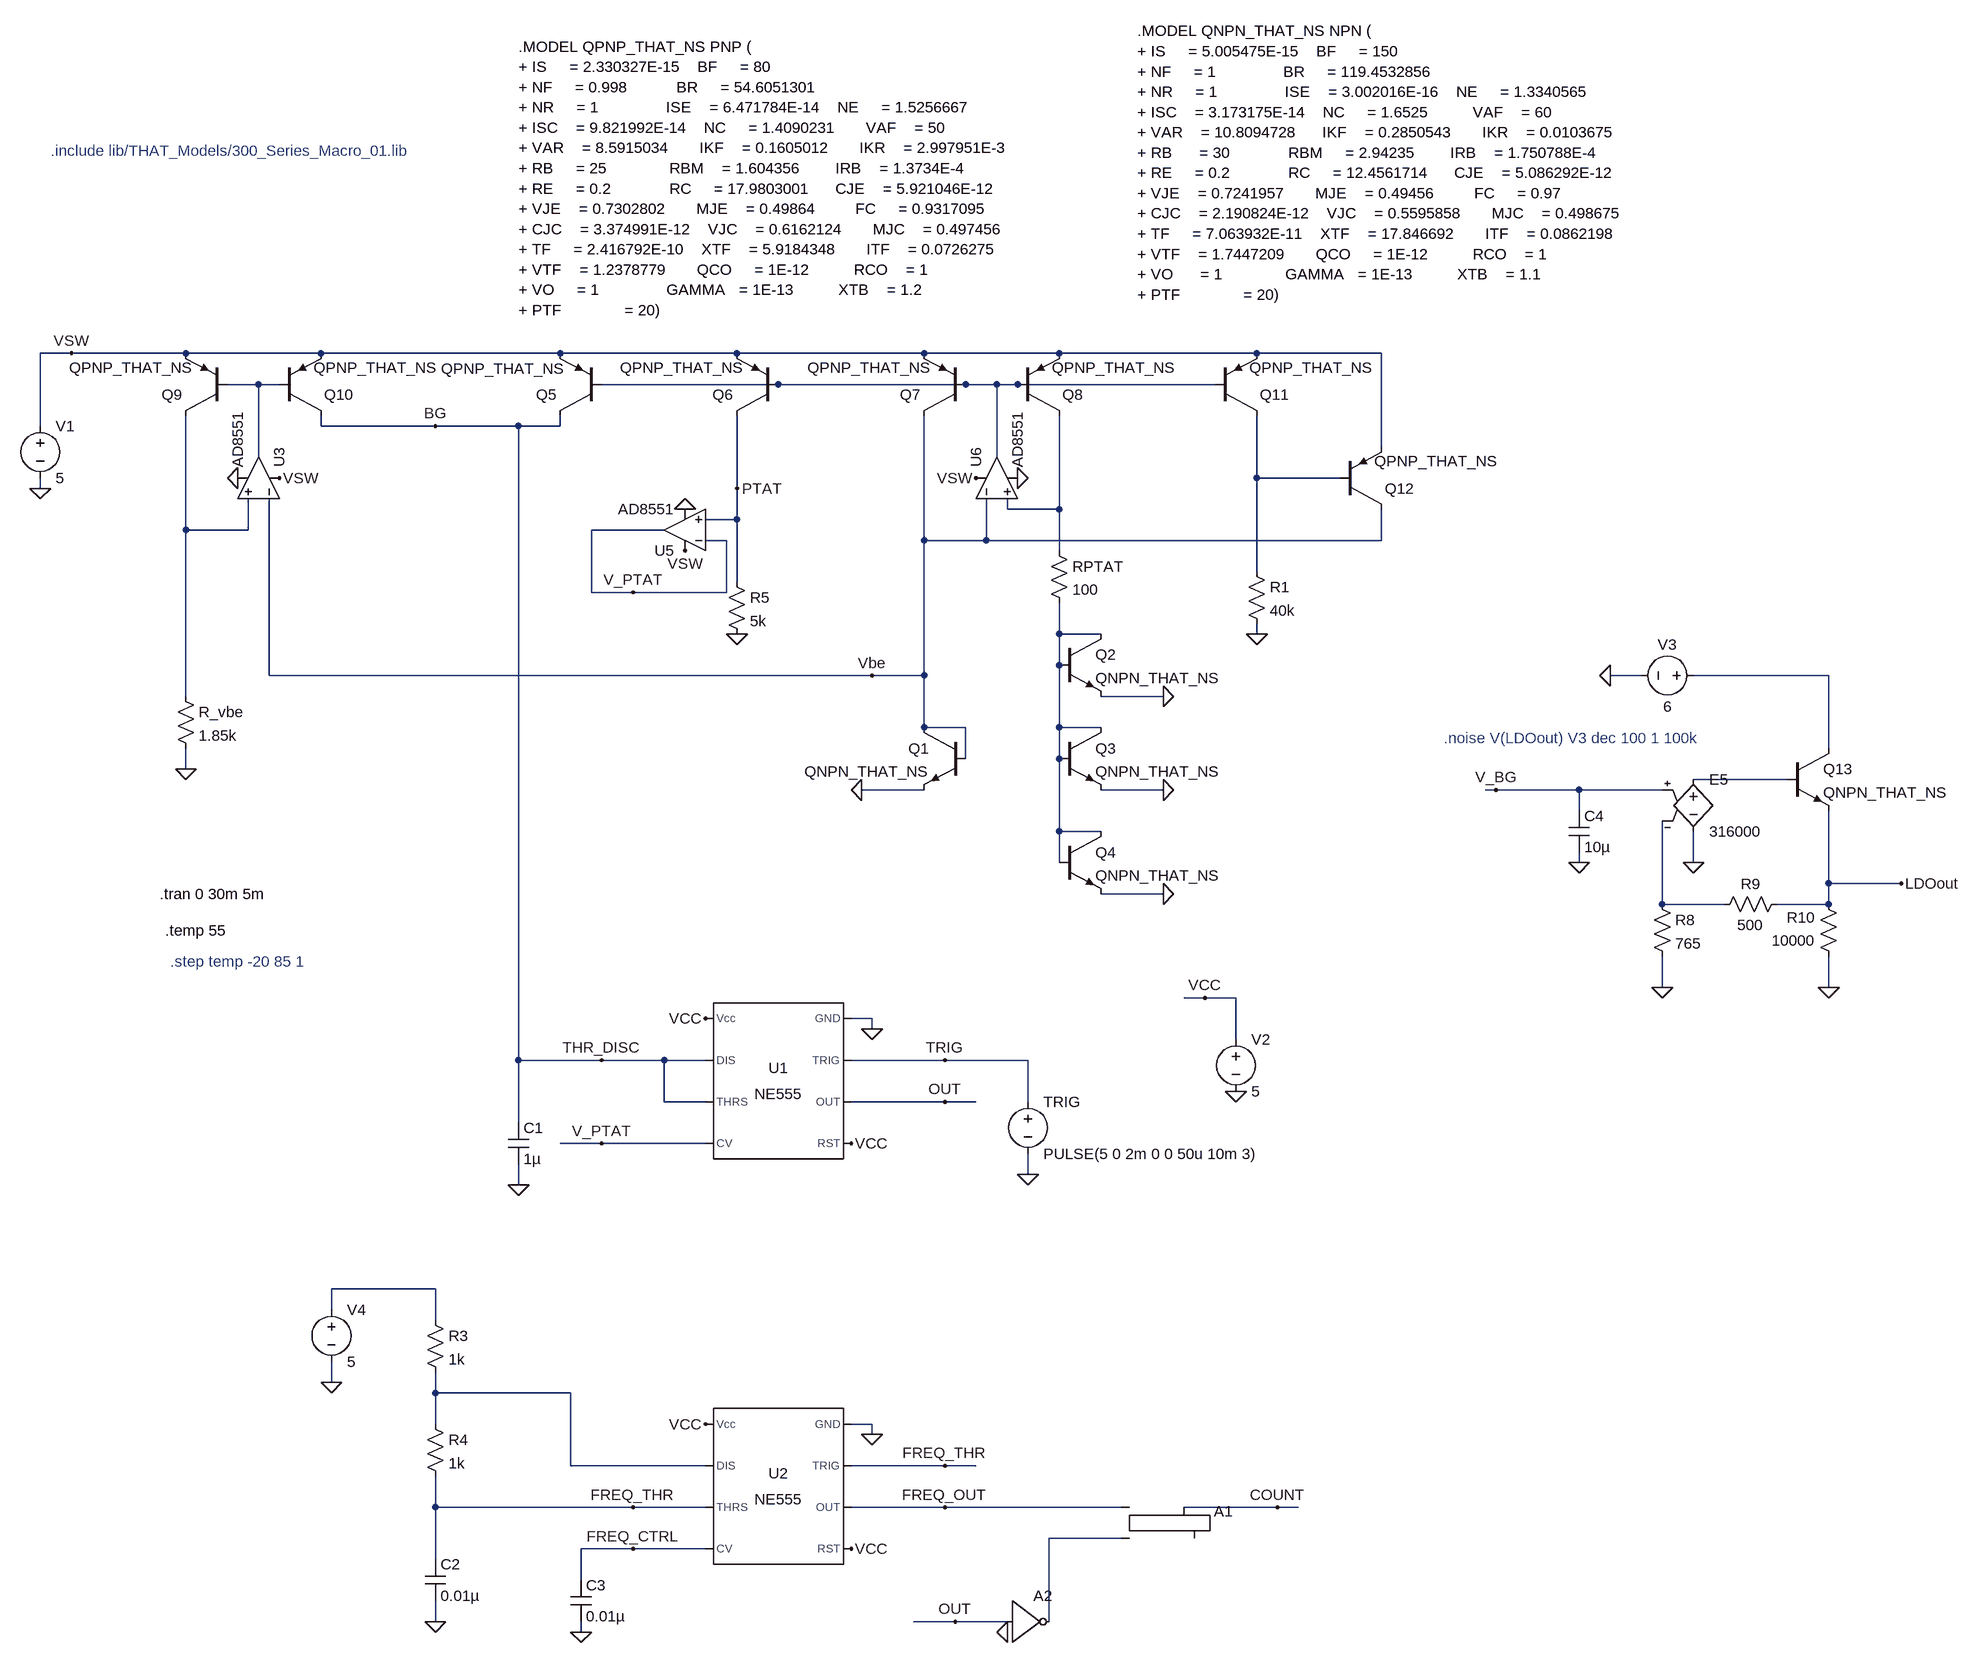
[diagram p0: schematic ECE_115D_555_Timer_IC.asc]
ECE_115D_555_Timer_IC.asc, the LTspice schematic file:
Version 4
SHEET 1 1912 2372
WIRE -1008 112 -1056 112
WIRE -832 112 -1008 112
WIRE -624 112 -832 112
WIRE -256 112 -624 112
WIRE 16 112 -256 112
WIRE 304 112 16 112
WIRE 512 112 304 112
WIRE 816 112 512 112
WIRE 1008 112 816 112
WIRE -720 160 -768 160
WIRE -688 160 -720 160
WIRE 80 160 -192 160
WIRE 368 160 80 160
WIRE 416 160 368 160
WIRE 448 160 416 160
WIRE 752 160 448 160
WIRE -1056 224 -1056 112
WIRE -624 224 -624 208
WIRE -448 224 -624 224
WIRE -320 224 -448 224
WIRE -256 224 -256 208
WIRE -256 224 -320 224
WIRE 1008 256 1008 112
WIRE -720 272 -720 160
WIRE 416 272 416 160
WIRE 816 304 816 208
WIRE 944 304 816 304
WIRE -1056 320 -1056 304
WIRE 16 320 16 208
WIRE 432 352 432 336
WIRE 512 352 512 208
WIRE 512 352 432 352
WIRE 16 368 16 320
WIRE 16 368 -32 368
WIRE -832 384 -832 208
WIRE -736 384 -736 336
WIRE -736 384 -832 384
WIRE -96 384 -208 384
WIRE 0 400 -32 400
WIRE 304 400 304 208
WIRE 400 400 400 336
WIRE 400 400 304 400
WIRE 1008 400 1008 352
WIRE 1008 400 400 400
WIRE 512 416 512 352
WIRE 816 448 816 304
WIRE 16 464 16 368
WIRE -208 480 -208 384
WIRE -144 480 -208 480
WIRE 0 480 0 400
WIRE 0 480 -144 480
WIRE 512 544 512 496
WIRE 576 544 512 544
WIRE 816 544 816 528
WIRE 512 592 512 544
WIRE -704 608 -704 336
WIRE 224 608 -704 608
WIRE 304 608 304 400
WIRE 304 608 224 608
WIRE 1408 608 1360 608
WIRE 1696 608 1488 608
WIRE -832 640 -832 384
WIRE 672 640 576 640
WIRE 304 688 304 608
WIRE 368 688 304 688
WIRE 512 688 512 592
WIRE 576 688 512 688
WIRE 1696 720 1696 608
WIRE 368 736 368 688
WIRE 512 736 512 688
WIRE -832 752 -832 720
WIRE 1632 768 1488 768
WIRE 304 784 208 784
WIRE 672 784 576 784
WIRE 1184 784 1168 784
WIRE 1312 784 1184 784
WIRE 1440 784 1312 784
WIRE 1312 816 1312 784
WIRE 512 848 512 736
WIRE 576 848 512 848
WIRE 512 896 512 848
WIRE 1312 896 1312 880
WIRE 1488 896 1488 848
WIRE 1696 928 1696 816
WIRE 1808 928 1696 928
WIRE 672 944 576 944
WIRE 1440 960 1440 832
WIRE 1536 960 1440 960
WIRE 1696 960 1696 928
WIRE 1696 960 1616 960
WIRE 1440 1088 1440 1040
WIRE 1696 1088 1696 1040
WIRE 736 1104 704 1104
WIRE 784 1104 736 1104
WIRE 224 1136 192 1136
WIRE 224 1152 224 1136
WIRE 784 1168 784 1104
WIRE -320 1200 -320 224
WIRE -192 1200 -320 1200
WIRE -96 1200 -192 1200
WIRE -32 1200 -96 1200
WIRE 336 1200 192 1200
WIRE 464 1200 336 1200
WIRE -96 1264 -96 1200
WIRE -32 1264 -96 1264
WIRE 336 1264 192 1264
WIRE 384 1264 336 1264
WIRE 464 1264 464 1200
WIRE -320 1296 -320 1200
WIRE -192 1328 -256 1328
WIRE -32 1328 -192 1328
WIRE 464 1376 464 1344
WIRE -320 1392 -320 1360
WIRE -448 1552 -608 1552
WIRE -608 1584 -608 1552
WIRE -448 1600 -448 1552
WIRE -608 1696 -608 1664
WIRE -448 1712 -448 1680
WIRE -240 1712 -448 1712
WIRE -448 1760 -448 1712
WIRE 224 1760 192 1760
WIRE 224 1776 224 1760
WIRE -240 1824 -240 1712
WIRE -32 1824 -240 1824
WIRE 336 1824 192 1824
WIRE 384 1824 336 1824
WIRE -448 1888 -448 1840
WIRE -144 1888 -448 1888
WIRE -32 1888 -144 1888
WIRE 336 1888 192 1888
WIRE 608 1888 336 1888
WIRE 848 1888 704 1888
WIRE 880 1888 848 1888
WIRE 608 1936 496 1936
WIRE -144 1952 -224 1952
WIRE -32 1952 -144 1952
WIRE -448 1968 -448 1888
WIRE -224 2000 -224 1952
WIRE -448 2064 -448 2032
WIRE 352 2064 288 2064
WIRE 432 2064 352 2064
WIRE 496 2064 496 1936
WIRE -224 2080 -224 2064
FLAG 208 784 0
FLAG 448 304 0
FLAG -832 752 0
FLAG 672 640 0
FLAG 672 784 0
FLAG 224 608 Vbe
FLAG 816 544 0
FLAG 464 1376 0
FLAG -320 1392 0
FLAG -448 224 BG
FLAG 16 544 0
FLAG 16 320 PTAT
FLAG 224 1152 0
FLAG 192 1328 VCC
FLAG -32 1136 VCC
FLAG 336 1200 TRIG
FLAG -192 1200 THR_DISC
FLAG 336 1264 OUT
FLAG 784 1248 0
FLAG 736 1104 VCC
FLAG -144 480 V_PTAT
FLAG -192 1328 V_PTAT
FLAG 672 944 0
FLAG -448 2064 0
FLAG 224 1776 0
FLAG 192 1952 VCC
FLAG -32 1760 VCC
FLAG -144 1888 FREQ_THR
FLAG 336 1888 FREQ_OUT
FLAG 336 1824 FREQ_THR
FLAG -224 2080 0
FLAG 848 1888 COUNT
FLAG 352 2064 OUT
FLAG 432 2080 0
FLAG 1488 896 0
FLAG 1696 1088 0
FLAG 1440 1088 0
FLAG 1312 896 0
FLAG 1184 784 V_BG
FLAG 1360 608 0
FLAG 1808 928 LDOout
FLAG -752 304 0
FLAG -64 352 0
FLAG -1056 320 0
FLAG -1008 112 VSW
FLAG -688 304 VSW
FLAG -64 416 VSW
FLAG 384 304 VSW
FLAG -144 1952 FREQ_CTRL
FLAG -608 1696 0
SYMBOL npn 368 688 M0
SYMATTR InstName Q1
SYMATTR Value QNPN_THAT_NS
SYMBOL res 496 400 R0
SYMATTR InstName RPTAT
SYMATTR Value 100
SYMBOL res -848 624 R0
SYMATTR InstName R_vbe
SYMATTR Value 1.85k
SYMBOL pnp -192 208 R180
WINDOW 0 69 32 Left 2
WINDOW 3 57 72 Left 2
SYMATTR InstName Q5
SYMATTR Value QPNP_THAT_NS
SYMBOL npn 512 544 R0
SYMATTR InstName Q2
SYMATTR Value QNPN_THAT_NS
SYMBOL npn 512 688 R0
SYMATTR InstName Q3
SYMATTR Value QNPN_THAT_NS
SYMBOL npn 512 848 R0
SYMATTR InstName Q4
SYMATTR Value QNPN_THAT_NS
SYMBOL pnp 80 208 R180
WINDOW 0 69 32 Left 2
WINDOW 3 53 74 Left 2
SYMATTR InstName Q6
SYMATTR Value QPNP_THAT_NS
SYMBOL pnp 368 208 R180
WINDOW 0 69 32 Left 2
WINDOW 3 53 74 Left 2
SYMATTR InstName Q7
SYMATTR Value QPNP_THAT_NS
SYMBOL pnp 448 208 M180
WINDOW 0 69 32 Left 2
WINDOW 3 53 74 Left 2
SYMATTR InstName Q8
SYMATTR Value QPNP_THAT_NS
SYMBOL pnp -768 208 R180
WINDOW 0 69 32 Left 2
WINDOW 3 53 74 Left 2
SYMATTR InstName Q9
SYMATTR Value QPNP_THAT_NS
SYMBOL pnp -688 208 M180
WINDOW 0 69 32 Left 2
WINDOW 3 53 74 Left 2
SYMATTR InstName Q10
SYMATTR Value QPNP_THAT_NS
SYMBOL pnp 752 208 M180
WINDOW 0 69 32 Left 2
WINDOW 3 53 74 Left 2
SYMATTR InstName Q11
SYMATTR Value QPNP_THAT_NS
SYMBOL pnp 944 352 M180
WINDOW 0 69 32 Left 2
WINDOW 3 53 74 Left 2
SYMATTR InstName Q12
SYMATTR Value QPNP_THAT_NS
SYMBOL res 800 432 R0
SYMATTR InstName R1
SYMATTR Value 40k
SYMBOL voltage 464 1248 R0
WINDOW 123 0 0 Left 0
WINDOW 39 0 0 Left 0
SYMATTR InstName TRIG
SYMATTR Value PULSE(5 0 2m 0 0 50u 10m 3)
SYMBOL cap -336 1296 R0
SYMATTR InstName C1
SYMATTR Value 1µ
SYMATTR SpiceLine V=16 Irms=0 Rser=0 Lser=0
SYMBOL res 0 448 R0
SYMATTR InstName R5
SYMATTR Value 5k
SYMBOL NE555 80 1232 M0
SYMATTR InstName U1
SYMBOL voltage 784 1152 R0
WINDOW 123 0 0 Left 0
WINDOW 39 0 0 Left 0
SYMATTR InstName V2
SYMATTR Value 5
SYMBOL cap -464 1968 R0
SYMATTR InstName C2
SYMATTR Value 0.01µ
SYMATTR SpiceLine V=16 Irms=0 Rser=0 Lser=0
SYMBOL res -464 1584 R0
SYMATTR InstName R3
SYMATTR Value 1k
SYMBOL NE555 80 1856 M0
SYMATTR InstName U2
SYMBOL cap -240 2000 R0
SYMATTR InstName C3
SYMATTR Value 0.01µ
SYMBOL res -464 1744 R0
SYMATTR InstName R4
SYMATTR Value 1k
SYMBOL srflop 656 1840 R0
WINDOW 3 0 0 Invisible 0
SYMATTR Value cycles=2
SYMATTR InstName A1
SYMATTR SpiceModel Counter
SYMBOL inv 432 2000 R0
SYMATTR InstName A2
SYMBOL npn 1632 720 R0
SYMATTR InstName Q13
SYMATTR Value QNPN_THAT_NS
SYMBOL e 1488 752 R0
SYMATTR InstName E5
SYMATTR Value 316000
SYMBOL Res 1424 944 R0
SYMATTR InstName R8
SYMATTR Value 765
SYMBOL Res 1632 944 R90
WINDOW 0 0 56 VBottom 2
WINDOW 3 32 56 VTop 2
SYMATTR InstName R9
SYMATTR Value 500
SYMBOL Res 1712 1056 R180
WINDOW 0 36 76 Left 2
WINDOW 3 36 40 Left 2
SYMATTR InstName R10
SYMATTR Value 10000
SYMBOL Voltage 1504 608 R90
WINDOW 0 -32 56 VBottom 2
WINDOW 3 32 56 VTop 2
SYMATTR InstName V3
SYMATTR Value 6
SYMBOL Cap 1296 816 R0
SYMATTR InstName C4
SYMATTR Value 10µ
SYMBOL AD8551 352 304 R270
SYMATTR InstName U6
SYMBOL AD8551 -656 304 M270
SYMATTR InstName U3
SYMBOL AD8551 -64 448 R180
SYMATTR InstName U5
SYMBOL voltage -1056 208 R0
WINDOW 123 0 0 Left 0
WINDOW 39 0 0 Left 0
SYMATTR InstName V1
SYMATTR Value 5
SYMBOL voltage -608 1568 R0
SYMATTR InstName V4
SYMATTR Value 5
TEXT -1040 -200 Left 2 ;.include lib/THAT_Models/300_Series_Macro_01.lib
TEXT 632 -384 Left 2 !.MODEL QNPN_THAT_NS NPN (\n+ IS     = 5.005475E-15    BF     = 150\n+ NF     = 1               BR     = 119.4532856 \n+ NR     = 1               ISE    = 3.002016E-16    NE     = 1.3340565\n+ ISC    = 3.173175E-14    NC     = 1.6525          VAF    = 60\n+ VAR    = 10.8094728      IKF    = 0.2850543       IKR    = 0.0103675\n+ RB      = 30             RBM     = 2.94235        IRB    = 1.750788E-4\n+ RE     = 0.2             RC     = 12.4561714      CJE    = 5.086292E-12\n+ VJE    = 0.7241957       MJE    = 0.49456         FC     = 0.97\n+ CJC    = 2.190824E-12    VJC    = 0.5595858       MJC    = 0.498675\n+ TF     = 7.063932E-11    XTF    = 17.846692       ITF    = 0.0862198\n+ VTF    = 1.7447209       QCO     = 1E-12          RCO    = 1\n+ VO      = 1              GAMMA   = 1E-13          XTB    = 1.1\n+ PTF              = 20)
TEXT -320 -360 Left 2 !.MODEL QPNP_THAT_NS PNP (\n+ IS     = 2.330327E-15    BF     = 80\n+ NF     = 0.998           BR     = 54.6051301\n+ NR     = 1               ISE    = 6.471784E-14    NE     = 1.5256667\n+ ISC    = 9.821992E-14    NC     = 1.4090231       VAF    = 50\n+ VAR    = 8.5915034       IKF    = 0.1605012       IKR    = 2.997951E-3\n+ RB     = 25              RBM    = 1.604356        IRB    = 1.3734E-4\n+ RE     = 0.2             RC     = 17.9803001      CJE    = 5.921046E-12\n+ VJE    = 0.7302802       MJE    = 0.49864         FC     = 0.9317095\n+ CJC    = 3.374991E-12    VJC    = 0.6162124       MJC    = 0.497456\n+ TF     = 2.416792E-10    XTF    = 5.9184348       ITF    = 0.0726275\n+ VTF    = 1.2378779       QCO     = 1E-12          RCO    = 1\n+ VO     = 1               GAMMA   = 1E-13          XTB    = 1.2\n+ PTF              = 20)
TEXT -872 944 Left 2 !.tran 0 30m 5m
TEXT -864 1000 Left 2 !.temp 55
TEXT 1104 704 Left 2 ;.noise V(LDOout) V3 dec 100 1 100k
TEXT -856 1048 Left 2 ;.step temp -20 85 1

The netlist it stands for:
* ECE_115D_555_Timer_IC.asc
Q1 Vbe Vbe 0 0 QNPN_THAT_NS
RPTAT N004 N006 100
R_vbe N005 0 1.85k
Q5 THR_DISC N002 VSW 0 QPNP_THAT_NS
Q2 N006 N006 0 0 QNPN_THAT_NS
Q3 N006 N006 0 0 QNPN_THAT_NS
Q4 N006 N006 0 0 QNPN_THAT_NS
Q6 PTAT N002 VSW 0 QPNP_THAT_NS
Q7 Vbe N002 VSW 0 QPNP_THAT_NS
Q8 N004 N002 VSW 0 QPNP_THAT_NS
Q9 N005 N001 VSW 0 QPNP_THAT_NS
Q10 THR_DISC N001 VSW 0 QPNP_THAT_NS
Q11 N003 N002 VSW 0 QPNP_THAT_NS
Q12 Vbe N003 VSW 0 QPNP_THAT_NS
R1 N003 0 40k
V§TRIG TRIG 0 PULSE(5 0 2m 0 0 50u 10m 3)
C1 THR_DISC 0 1µ V=16 Irms=0 Rser=0 Lser=0
R5 PTAT 0 5k
XU1 0 TRIG OUT VCC V_PTAT THR_DISC THR_DISC VCC NE555  ; pins GND TRIG OUT RST CV THRS DIS Vcc
V2 VCC 0 5
C2 FREQ_THR 0 0.01µ V=16 Irms=0 Rser=0 Lser=0
R3 N010 N011 1k
XU2 0 FREQ_THR FREQ_OUT VCC FREQ_CTRL FREQ_THR N011 VCC NE555  ; pins GND TRIG OUT RST CV THRS DIS Vcc
C3 FREQ_CTRL 0 0.01µ
R4 N011 FREQ_THR 1k
A1 FREQ_OUT N012 0 0 0 0 COUNT 0 Counter cycles=2
A2 OUT 0 0 0 0 N012 0 0 BUF
Q13 N007 N008 LDOout 0 QNPN_THAT_NS
E5 N008 0 V_BG N009 316000
R8 N009 0 765
R9 LDOout N009 500
R10 0 LDOout 10000
V3 N007 0 6
C4 V_BG 0 10µ
* U6: AD8551 (symbol AD8551 not available, pins judged from their places): In+=N004 In-=Vbe V+=VSW V-=0 OUT=N002
* U3: AD8551 (symbol AD8551 not available, pins judged from their places): In+=N005 In-=Vbe V+=VSW V-=0 OUT=N001
* U5: AD8551 (symbol AD8551 not available, pins judged from their places): In+=PTAT In-=V_PTAT V+=VSW V-=0 OUT=V_PTAT
V1 VSW 0 5
V4 N010 0 5
.model NPN NPN
.model PNP PNP
.lib standard.bjt
* .include lib/THAT_Models/300_Series_Macro_01.lib
.MODEL QNPN_THAT_NS NPN (
+ IS     = 5.005475E-15    BF     = 150
+ NF     = 1               BR     = 119.4532856
+ NR     = 1               ISE    = 3.002016E-16    NE     = 1.3340565
+ ISC    = 3.173175E-14    NC     = 1.6525          VAF    = 60
+ VAR    = 10.8094728      IKF    = 0.2850543       IKR    = 0.0103675
+ RB      = 30             RBM     = 2.94235        IRB    = 1.750788E-4
+ RE     = 0.2             RC     = 12.4561714      CJE    = 5.086292E-12
+ VJE    = 0.7241957       MJE    = 0.49456         FC     = 0.97
+ CJC    = 2.190824E-12    VJC    = 0.5595858       MJC    = 0.498675
+ TF     = 7.063932E-11    XTF    = 17.846692       ITF    = 0.0862198
+ VTF    = 1.7447209       QCO     = 1E-12          RCO    = 1
+ VO      = 1              GAMMA   = 1E-13          XTB    = 1.1
+ PTF              = 20)
.MODEL QPNP_THAT_NS PNP (
+ IS     = 2.330327E-15    BF     = 80
+ NF     = 0.998           BR     = 54.6051301
+ NR     = 1               ISE    = 6.471784E-14    NE     = 1.5256667
+ ISC    = 9.821992E-14    NC     = 1.4090231       VAF    = 50
+ VAR    = 8.5915034       IKF    = 0.1605012       IKR    = 2.997951E-3
+ RB     = 25              RBM    = 1.604356        IRB    = 1.3734E-4
+ RE     = 0.2             RC     = 17.9803001      CJE    = 5.921046E-12
+ VJE    = 0.7302802       MJE    = 0.49864         FC     = 0.9317095
+ CJC    = 3.374991E-12    VJC    = 0.6162124       MJC    = 0.497456
+ TF     = 2.416792E-10    XTF    = 5.9184348       ITF    = 0.0726275
+ VTF    = 1.2378779       QCO     = 1E-12          RCO    = 1
+ VO     = 1               GAMMA   = 1E-13          XTB    = 1.2
+ PTF              = 20)
.tran 0 30m 5m
.temp 55
* .noise V(LDOout) V3 dec 100 1 100k
* .step temp -20 85 1
.lib NE555.sub
.backanno
.end